# Altium schematic sheet top_overview.SchDoc
size 297 x 209 mm; DrawnBy: Supun; Engineer: Supun; Organization: C3
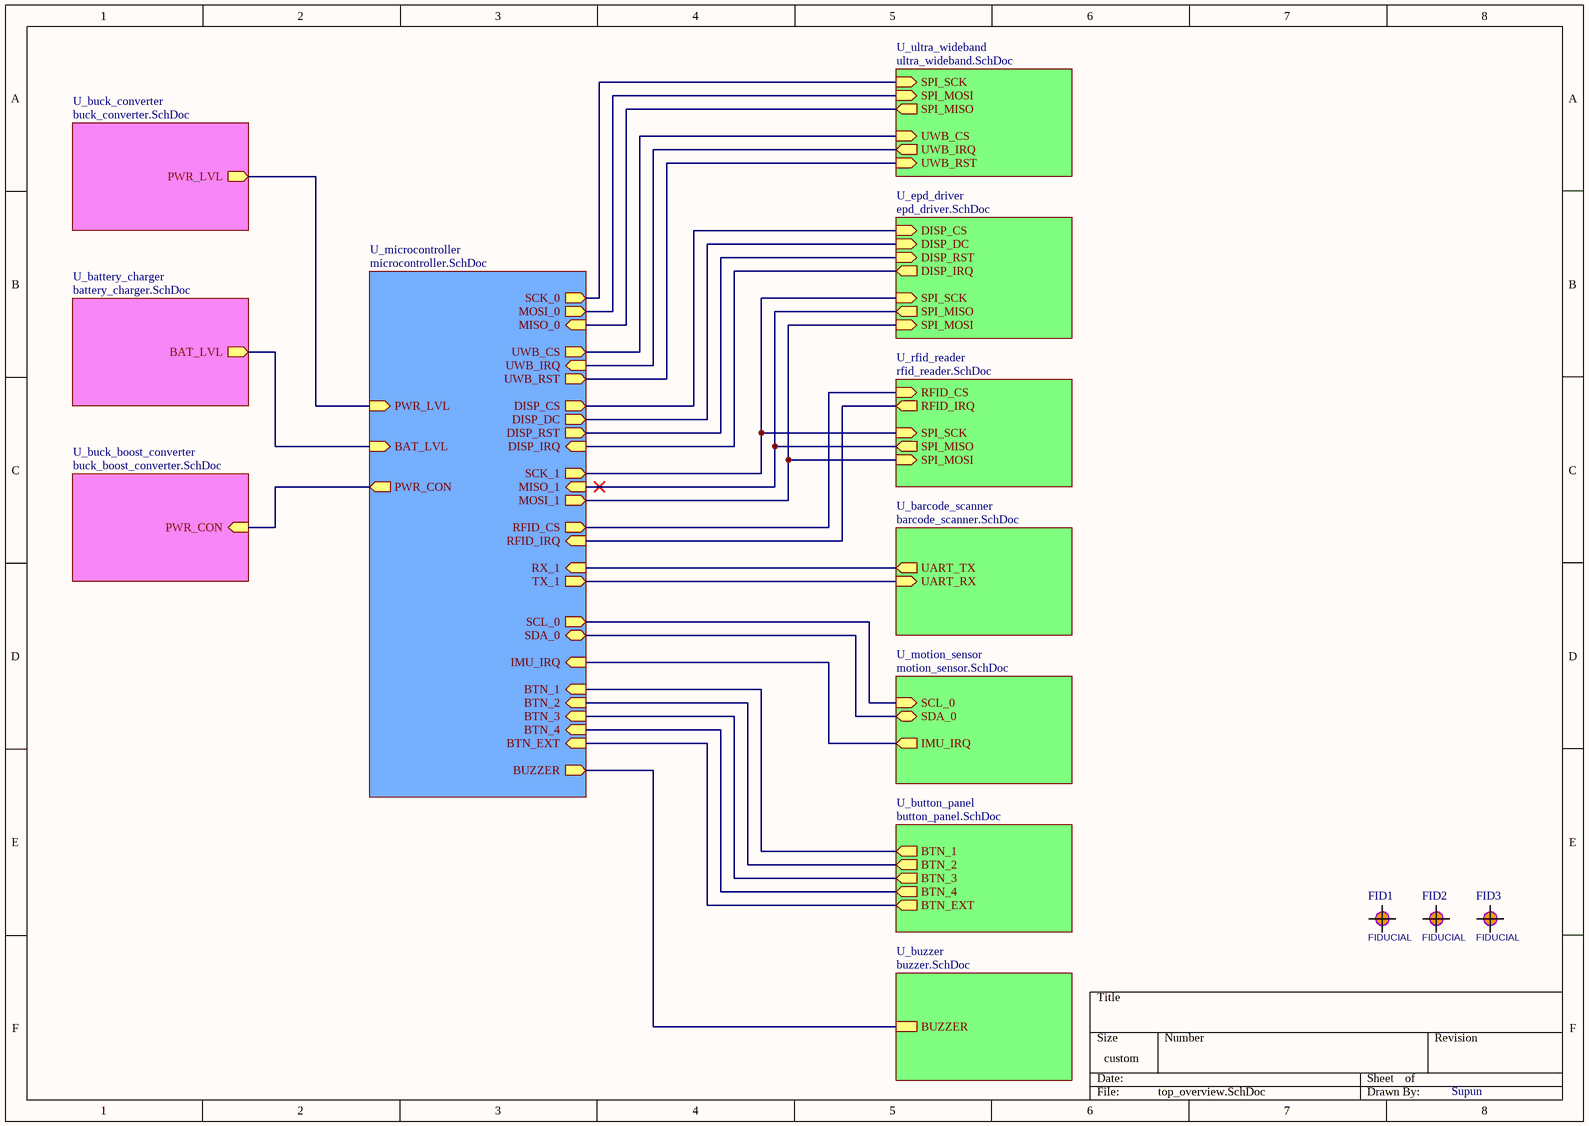
[diagram p0: top_overview.SchDoc]

## Parts
FID1  FIDUCIAL  [FIDUCIAL1SM2]  (no BOM)
FID2  FIDUCIAL  [FIDUCIAL1SM2]  (no BOM)
FID3  FIDUCIAL  [FIDUCIAL1SM2]  (no BOM)

## Sub-sheets
U_barcode_scanner = barcode_scanner.SchDoc: UART_TX (out), UART_RX (in)
U_battery_charger = battery_charger.SchDoc: BAT_LVL (out)
U_buck_boost_converter = buck_boost_converter.SchDoc: PWR_CON (in)
U_buck_converter = buck_converter.SchDoc: PWR_LVL (out)
U_button_panel = button_panel.SchDoc: BTN_EXT (out), BTN_2 (out), BTN_4 (out), BTN_1 (out), BTN_3 (out)
U_buzzer = buzzer.SchDoc: BUZZER
U_epd_driver = epd_driver.SchDoc: SPI_MISO (out), DISP_CS (in), DISP_DC (in), SPI_SCK (in), SPI_MOSI (in), DISP_IRQ (out), DISP_RST (in)
U_microcontroller = microcontroller.SchDoc: RFID_IRQ (in), DISP_DC (out), RFID_CS (out), DISP_CS (out), BUZZER (out), DISP_RST (out), MISO_1 (in), MOSI_1 (out), SCK_1 (out), MOSI_0 (out), UWB_CS (out), SCK_0 (out), UWB_IRQ (in), UWB_RST (out), MISO_0 (in), BTN_2 (in), RX_1 (in), BTN_1 (in), BTN_4 (in), TX_1 (out), BTN_3 (in), BTN_EXT (in), PWR_CON (out), BAT_LVL (in), SDA_0 (bidir), SCL_0 (out), DISP_IRQ (in), IMU_IRQ (in), PWR_LVL (in)
U_motion_sensor = motion_sensor.SchDoc: SCL_0 (in), IMU_IRQ (out), SDA_0 (bidir)
U_rfid_reader = rfid_reader.SchDoc: RFID_IRQ (out), SPI_SCK (in), SPI_MISO (out), RFID_CS (in), SPI_MOSI (in)
U_ultra_wideband = ultra_wideband.SchDoc: SPI_MISO (out), UWB_IRQ (out), UWB_RST (in), UWB_CS (in), SPI_SCK (in), SPI_MOSI (in)

## Nets
(unnamed): sheet U_battery_charger/BAT_LVL, sheet U_microcontroller/BAT_LVL
(unnamed): sheet U_buck_boost_converter/PWR_CON, sheet U_microcontroller/PWR_CON
(unnamed): sheet U_microcontroller/RFID_IRQ, sheet U_rfid_reader/RFID_IRQ
(unnamed): sheet U_microcontroller/DISP_DC, sheet U_epd_driver/DISP_DC
(unnamed): sheet U_microcontroller/RFID_CS, sheet U_rfid_reader/RFID_CS
(unnamed): sheet U_microcontroller/DISP_CS, sheet U_epd_driver/DISP_CS
(unnamed): sheet U_microcontroller/BUZZER, sheet U_buzzer/BUZZER
(unnamed): sheet U_microcontroller/DISP_RST, sheet U_epd_driver/DISP_RST
(unnamed): sheet U_microcontroller/MISO_1, sheet U_rfid_reader/SPI_MISO, sheet U_epd_driver/SPI_MISO
(unnamed): sheet U_microcontroller/MOSI_1, sheet U_rfid_reader/SPI_MOSI, sheet U_epd_driver/SPI_MOSI
(unnamed): sheet U_microcontroller/SCK_1, sheet U_rfid_reader/SPI_SCK, sheet U_epd_driver/SPI_SCK
(unnamed): sheet U_microcontroller/MOSI_0, sheet U_ultra_wideband/SPI_MOSI
(unnamed): sheet U_microcontroller/UWB_CS, sheet U_ultra_wideband/UWB_CS
(unnamed): sheet U_microcontroller/SCK_0, sheet U_ultra_wideband/SPI_SCK
(unnamed): sheet U_microcontroller/UWB_IRQ, sheet U_ultra_wideband/UWB_IRQ
(unnamed): sheet U_microcontroller/UWB_RST, sheet U_ultra_wideband/UWB_RST
(unnamed): sheet U_microcontroller/MISO_0, sheet U_ultra_wideband/SPI_MISO
(unnamed): sheet U_microcontroller/BTN_2, sheet U_button_panel/BTN_2
(unnamed): sheet U_microcontroller/RX_1, sheet U_barcode_scanner/UART_TX
(unnamed): sheet U_microcontroller/BTN_1, sheet U_button_panel/BTN_1
(unnamed): sheet U_microcontroller/BTN_4, sheet U_button_panel/BTN_4
(unnamed): sheet U_microcontroller/TX_1, sheet U_barcode_scanner/UART_RX
(unnamed): sheet U_microcontroller/BTN_3, sheet U_button_panel/BTN_3
(unnamed): sheet U_microcontroller/BTN_EXT, sheet U_button_panel/BTN_EXT
(unnamed): sheet U_microcontroller/SDA_0, sheet U_motion_sensor/SDA_0
(unnamed): sheet U_microcontroller/SCL_0, sheet U_motion_sensor/SCL_0
(unnamed): sheet U_microcontroller/DISP_IRQ, sheet U_epd_driver/DISP_IRQ
(unnamed): sheet U_microcontroller/IMU_IRQ, sheet U_motion_sensor/IMU_IRQ
(unnamed): sheet U_microcontroller/PWR_LVL, sheet U_buck_converter/PWR_LVL

## Notes on the sheet
- Title
- Size:
- Date:
- A4
- Number:
- Time:
- Revision:
- Sheet
- of
- File:

## Library data of the parts
FID1-FID3 = Fiducial: FIDUCIAL PCB ASSEMBLY AUTOMATED SMT; MF: SAH; ASSEMBLY: DNP; VALUE: FIDUCIAL